# Altium schematic sheet Sheet1.SchDoc
size A
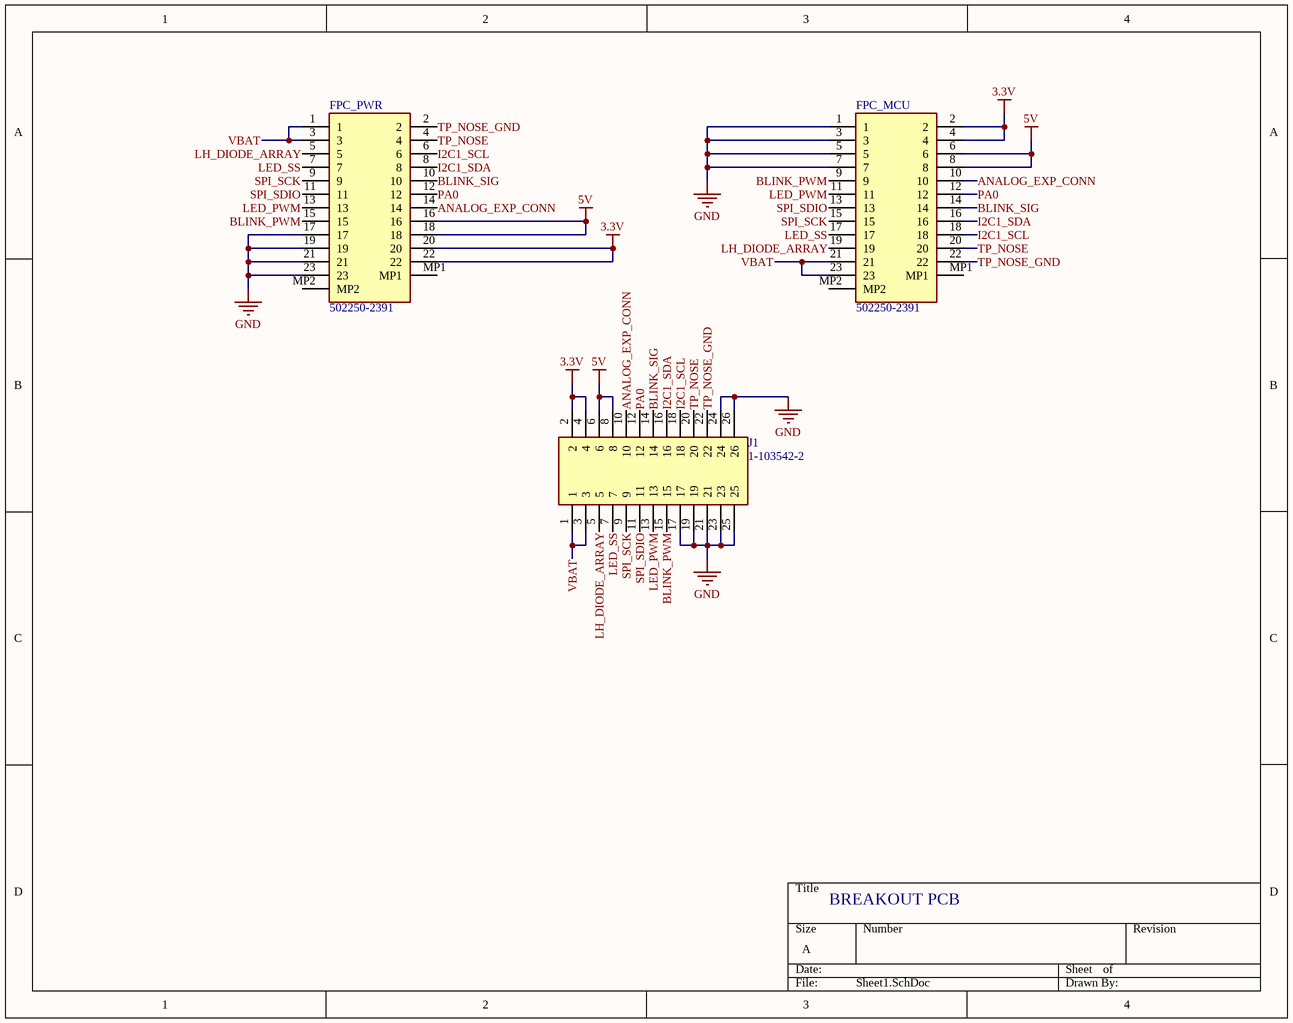
[diagram p0: Sheet1.SchDoc]

## Parts
FPC_MCU  502250-2391  [5022502391]
FPC_PWR  502250-2391  [5022502391]
J1  1-103542-2  [HDRV26W89P254X254_2X13_3261X506X1074P]

## Nets
3.3V: FPC_MCU.2 FPC_MCU.4 FPC_PWR.20 FPC_PWR.22 J1.2 J1.4
5V: FPC_MCU.6 FPC_MCU.8 FPC_PWR.16 FPC_PWR.18 J1.6 J1.8
GND: FPC_MCU.1 FPC_MCU.3 FPC_MCU.5 FPC_MCU.7 FPC_PWR.17 FPC_PWR.19 FPC_PWR.21 FPC_PWR.23 J1.17 J1.19 J1.21 J1.23 J1.24 J1.25 J1.26
ANALOG_EXP_CONN: FPC_MCU.10 FPC_PWR.14 J1.10
BLINK_PWM: FPC_MCU.9 FPC_PWR.15 J1.15
BLINK_SIG: FPC_MCU.14 FPC_PWR.10 J1.14
I2C1_SCL: FPC_MCU.18 FPC_PWR.6 J1.18
I2C1_SDA: FPC_MCU.16 FPC_PWR.8 J1.16
LED_PWM: FPC_MCU.11 FPC_PWR.13 J1.13
LED_SS: FPC_MCU.17 FPC_PWR.7 J1.7
LH_DIODE_ARRAY: FPC_MCU.19 FPC_PWR.5 J1.5
PA0: FPC_MCU.12 FPC_PWR.12 J1.12
SPI_SCK: FPC_MCU.15 FPC_PWR.9 J1.9
SPI_SDIO: FPC_MCU.13 FPC_PWR.11 J1.11
TP_NOSE: FPC_MCU.20 FPC_PWR.4 J1.20
TP_NOSE_GND: FPC_MCU.22 FPC_PWR.2 J1.22
VBAT: FPC_MCU.21 FPC_MCU.23 FPC_PWR.1 FPC_PWR.3 J1.1 J1.3

Not connected (* = marked no-connect by the designer): FPC_MCU MP1 MP2; FPC_PWR MP1 MP2

## Notes on the sheet
- BREAKOUT PCB

## Library data of the parts
FPC_MCU FPC_PWR = 502250-2391: Connector; Manufacturer_Name: Molex; Datasheet Link: https://www.molex.com/pdm_docs/sd/5022501791_sd.pdf; Height: 1.85mm; Manufacturer_Part_Number: 502250-2391; Mouser Part Number: 538-502250-2391; Mouser Price/Stock: https://www.mouser.com/Search/Refine.aspx?Keyword=538-502250-2391; System: Connector
J1 = 1-103542-2: Connector; Manufacturer_Name: TE Connectivity; Datasheet Link: http://www.te.com/commerce/DocumentDelivery/DDEController?Action=showdoc&DocId=Customer+Drawing%7F103542%7FJ3%7Fpdf%7FEnglish%7FENG_CD_103542_J3.pdf%7F1-103542-2; Height: 10.744mm; Manufacturer_Part_Number: 1-103542-2; Mouser Part Number: 571-1-103542-2; Mouser Price/Stock: https://www.mouser.com/Search/Refine.aspx?Keyword=571-1-103542-2